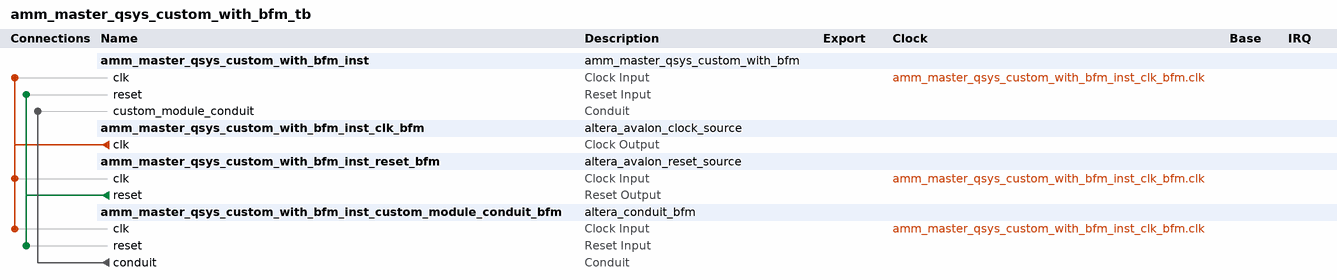
[diagram p0: system contents]
# Platform Designer (Qsys) system amm_master_qsys_custom_with_bfm_tb, Cyclone IV GX EP4CGX150DF31C7
# Parameters at their usual value, and those the tool derives, are not listed.
package require -exact qsys 13.0
create_system amm_master_qsys_custom_with_bfm_tb
set_project_property DEVICE_FAMILY {Cyclone IV GX}
set_project_property DEVICE EP4CGX150DF31C7

add_instance amm_master_qsys_custom_with_bfm_inst amm_master_qsys_custom_with_bfm 1.0

add_instance amm_master_qsys_custom_with_bfm_inst_clk_bfm altera_avalon_clock_source 13.0

add_instance amm_master_qsys_custom_with_bfm_inst_reset_bfm altera_avalon_reset_source 13.0
set_instance_parameter_value amm_master_qsys_custom_with_bfm_inst_reset_bfm ASSERT_HIGH_RESET 0
set_instance_parameter_value amm_master_qsys_custom_with_bfm_inst_reset_bfm INITIAL_RESET_CYCLES 50

add_instance amm_master_qsys_custom_with_bfm_inst_custom_module_conduit_bfm altera_conduit_bfm 13.0
set_instance_parameter_value amm_master_qsys_custom_with_bfm_inst_custom_module_conduit_bfm CLOCKED_SIGNAL true
set_instance_parameter_value amm_master_qsys_custom_with_bfm_inst_custom_module_conduit_bfm ENABLE_RESET true
set_instance_parameter_value amm_master_qsys_custom_with_bfm_inst_custom_module_conduit_bfm SIGNAL_ROLES rdwr_cntl,add_data_sel,rdwr_address,n_action,display_data
set_instance_parameter_value amm_master_qsys_custom_with_bfm_inst_custom_module_conduit_bfm SIGNAL_WIDTHS 1,1,26,1,26
set_instance_parameter_value amm_master_qsys_custom_with_bfm_inst_custom_module_conduit_bfm SIGNAL_DIRECTIONS output,output,output,output,input

# connections
add_connection amm_master_qsys_custom_with_bfm_inst_clk_bfm.clk amm_master_qsys_custom_with_bfm_inst.clk clock
add_connection amm_master_qsys_custom_with_bfm_inst_clk_bfm.clk amm_master_qsys_custom_with_bfm_inst_custom_module_conduit_bfm.clk clock
add_connection amm_master_qsys_custom_with_bfm_inst_clk_bfm.clk amm_master_qsys_custom_with_bfm_inst_reset_bfm.clk clock
add_connection amm_master_qsys_custom_with_bfm_inst_reset_bfm.reset amm_master_qsys_custom_with_bfm_inst.reset reset
add_connection amm_master_qsys_custom_with_bfm_inst_reset_bfm.reset amm_master_qsys_custom_with_bfm_inst_custom_module_conduit_bfm.reset reset
add_connection amm_master_qsys_custom_with_bfm_inst_custom_module_conduit_bfm.conduit amm_master_qsys_custom_with_bfm_inst.custom_module_conduit conduit

set_interconnect_requirement {$system} qsys_mm.clockCrossingAdapter HANDSHAKE
set_interconnect_requirement {$system} qsys_mm.maxAdditionalLatency 1

save_system amm_master_qsys_custom_with_bfm_tb.qsys
